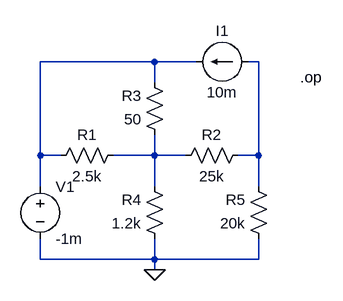
[diagram p0: schematic Draft1.asc]
Draft1.asc, the LTspice schematic file:
Version 4
SHEET 1 880 680
WIRE 176 0 0 0
WIRE 240 0 176 0
WIRE 336 0 320 0
WIRE 176 32 176 0
WIRE 0 144 0 0
WIRE 32 144 0 144
WIRE 176 144 176 112
WIRE 176 144 112 144
WIRE 224 144 176 144
WIRE 336 144 336 0
WIRE 336 144 304 144
WIRE 0 192 0 144
WIRE 176 192 176 144
WIRE 336 192 336 144
WIRE 0 304 0 272
WIRE 176 304 176 272
WIRE 176 304 0 304
WIRE 336 304 336 272
WIRE 336 304 176 304
WIRE 176 320 176 304
FLAG 176 320 0
SYMBOL res 128 128 R90
WINDOW 0 0 56 VBottom 2
WINDOW 3 32 56 VTop 2
SYMATTR InstName R1
SYMATTR Value 2.5k
SYMBOL res 320 128 R90
WINDOW 0 0 56 VBottom 2
WINDOW 3 32 56 VTop 2
SYMATTR InstName R2
SYMATTR Value 25k
SYMBOL res 192 128 R180
WINDOW 0 36 76 Left 2
WINDOW 3 36 40 Left 2
SYMATTR InstName R3
SYMATTR Value 50
SYMBOL res 192 288 R180
WINDOW 0 36 76 Left 2
WINDOW 3 36 40 Left 2
SYMATTR InstName R4
SYMATTR Value 1.2k
SYMBOL res 352 288 R180
WINDOW 0 36 76 Left 2
WINDOW 3 36 40 Left 2
SYMATTR InstName R5
SYMATTR Value 20k
SYMBOL voltage 0 176 R0
WINDOW 123 0 0 Left 2
WINDOW 39 0 0 Left 2
SYMATTR InstName V1
SYMATTR Value -1m
SYMBOL current 320 0 R90
WINDOW 0 -32 40 VBottom 2
WINDOW 3 31 40 VTop 2
WINDOW 123 0 0 Left 2
WINDOW 39 0 0 Left 2
SYMATTR InstName I1
SYMATTR Value 10m
TEXT 400 24 Left 2 !.op

The netlist it stands for:
* Draft1.asc
R1 N003 N001 2.5k
R2 N002 N003 25k
R3 N003 N001 50
R4 0 N003 1.2k
R5 0 N002 20k
V1 N001 0 -1m
I1 N002 N001 10m
.op
.backanno
.end